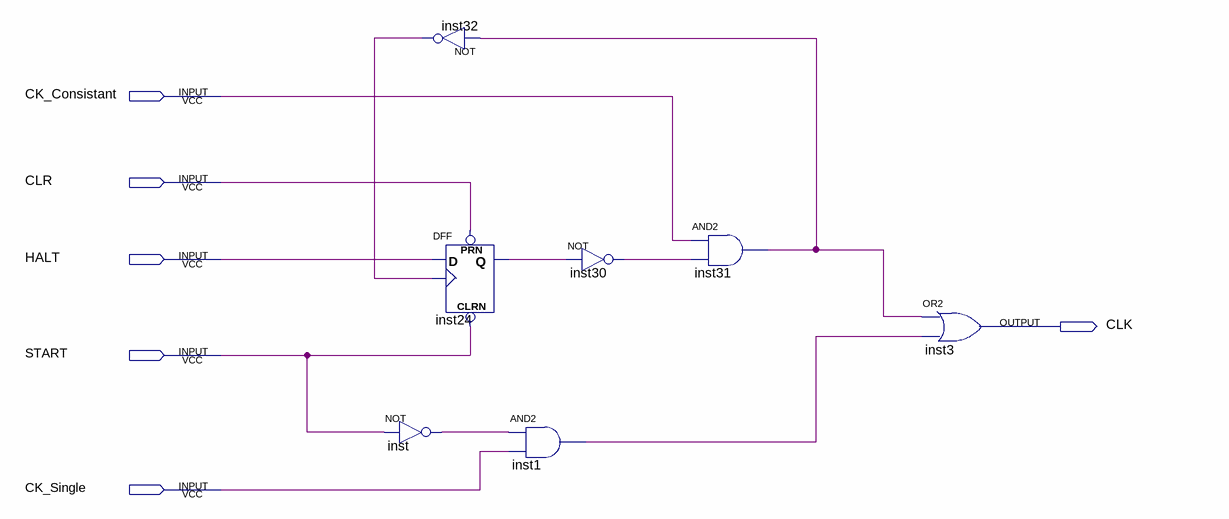
[diagram p0: schematic sheet]
// Quartus schematic start_stop_selection.bdf as structural Verilog: 7 symbols, 6 pins
module start_stop_selection (
  input  CK_Consistant,
  input  CLR,
  input  HALT,
  input  START,
  input  CK_Single,
  output CLK
);

  wire inst1_out, inst24_q, inst30_out, inst31_out, inst32_out, inst_out;

  not inst32 (inst32_out, inst31_out);
  DFF inst24 (.CLRN(START), .CLK(inst32_out), .D(HALT), .PRN(CLR), .Q(inst24_q));
  not inst (inst_out, START);
  and inst1 (inst1_out, inst_out, CK_Single);
  not inst30 (inst30_out, inst24_q);
  and inst31 (inst31_out, CK_Consistant, inst30_out);
  or inst3 (CLK, inst31_out, inst1_out);
endmodule
